# Altium project chatluongkhong khi.PrjPcb
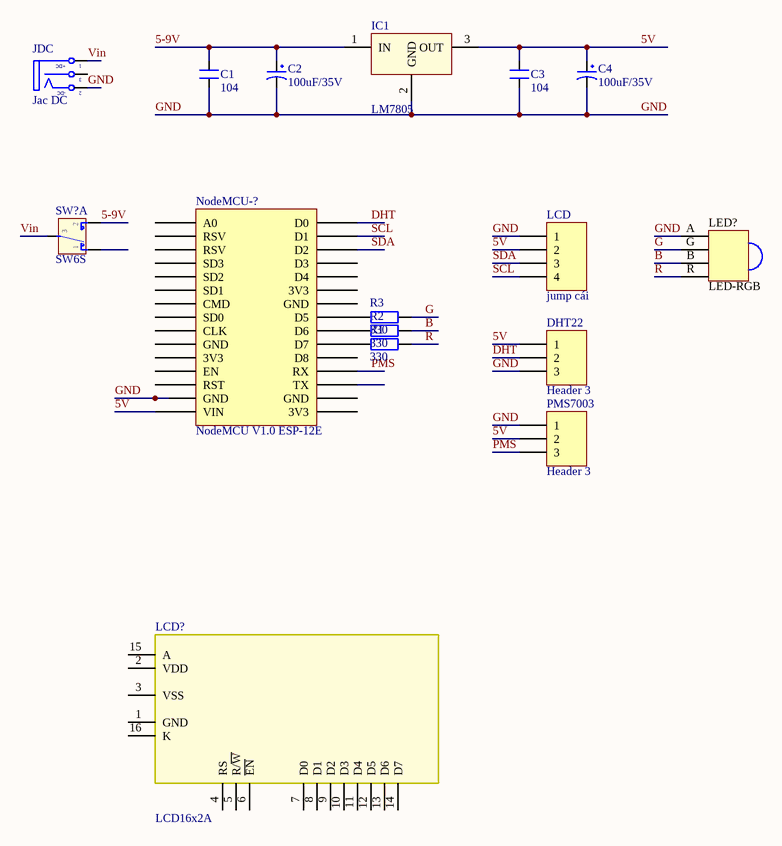
[diagram p0: Sheet1.SchDoc]
1 sheet, 16 parts. Net scope: global (net labels, ports and power ports of the same name join across sheets).
Board file: PCB1.PcbDoc

## Sheet Sheet1.SchDoc
size A

### Parts
C1  104  [CN1.5]
C2  100uF/35V  [CP1.5/3.4]
C3  104  [CN1.5]
C4  100uF/35V  [CP1.5/3.4]
DHT22  Header 3  [HDR1X3]
IC1  LM7805  [QTO-220H3]
JDC  Jac DC  [DC-IN]
LCD  jump cái  [HDR1X4]
LCD?  LCD16x2A  [LCD16X2]
LED?  LED-RGB  [LED-5MMRGBCA]
NodeMCU-?  NodeMCU V1.0 ESP-12E  [NodeMCU V1.0 ESP-12E]
PMS7003  Header 3  [HDR1X3]
R1  330  [R1/2W]
R2  330  [R1/2W]
R3  330  [R1/2W]
SW?  SW6S  [SW6]  (part A of 2)

### Nets
5-9V: C1.2 C2.1 IC1.1(IN) SW?.2
5V: C3.2 C4.1 DHT22.1 IC1.3(OUT) LCD.2 NodeMCU-?.VIN PMS7003.2
B: LED?.B R2.2
DHT: DHT22.2 NodeMCU-?.D0
G: LED?.G R3.2
GND: C1.1 C2.2 C3.1 C4.2 DHT22.3 IC1.2(GND) JDC.2(TN) LCD.1 LED?.A NodeMCU-?.GND PMS7003.1
PMS: NodeMCU-?.RX PMS7003.3
R: LED?.R R1.2
SCL: LCD.4 NodeMCU-?.D1
SDA: LCD.3 NodeMCU-?.D2
Vin: JDC.1(T) SW?.3
NetNodeMCU-?_D5: NodeMCU-?.D5 R3.1
NetNodeMCU-?_D6: NodeMCU-?.D6 R2.1
NetNodeMCU-?_D7: NodeMCU-?.D7 R1.1

Not connected (* = marked no-connect by the designer): JDC 3(S); LCD? 1(GND) 2(VDD) 3(VSS) 4(RS) 5(R/~{W}) 6(~{EN}) 7(D0) 8(D1) 9(D2) 10(D3) 11(D4) 12(D5) 13(D6) 14(D7) 15(A) 16(K); NodeMCU-? 3V3 A0 CLK CMD D3 D4 D8 EN RST RSV SD0 SD1 SD2 SD3 TX; SW? 1

### Notes on the sheet
- (in symbol DCIN) +DC; -DC

### Library data of the parts
C1 C3 = CN1.5: Cap np 682pF => 104pF; Value: 0.01uF
C2 C4 = CP3: Cap 100uF/35V - 470uF/16V; Value: 100uF/35V/50V; Description 1: 1000uF/6,3V - 470uF/16V - 330uF - 25V; Description 2: 220uF/35V - 100uF/50V - 63V - 4,7uF/200V; Description 3: 22uF => 33uF100V - 3,3uF => 4,7uF/250V; Description 4: 2,2uF =>3,3uF/350 - 2,2uF/400V - 1uF/450V
DHT22 PMS7003 = Header 3: Header, 3-Pin; LatestRevisionDate: 17-Jul-2002; LatestRevisionNote: Re-released for DXP Platform.; Publisher: Altium Limited
IC1 = LM78xx: On ap +, from + 5 to + 24VDC; Value: LM7805
JDC = DCIN: Jac DC input; Value: Jac DC
LCD = Header 4: Header, 4-Pin; LatestRevisionDate: 17-Jul-2002; LatestRevisionNote: Re-released for DXP Platform.; Publisher: Altium Limited
LCD? = LCD16x2: LCD dipslay 16 char, 2 line; Value: LCD16x2A
NodeMCU-? = NodeMCU V1.0 ESP-12E: NodeMCU V1.0 ESP8266 (ESP-12E)
R1-R3 = R1/4W: Resistor 1/4W; Value: R1/4W - 1K
SW? = SW6S: SW-DTDP - 6 Pin; Value: SW6